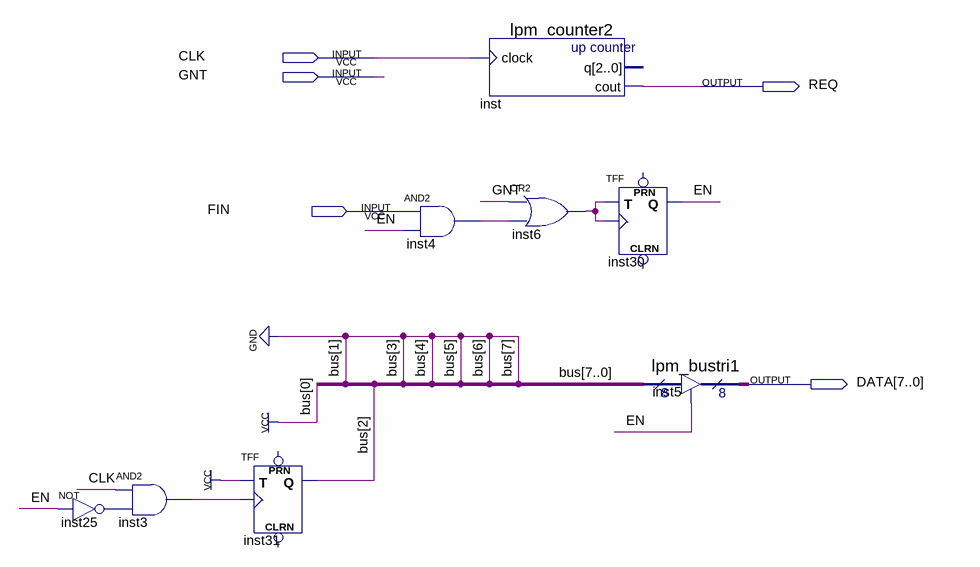
[diagram p0: schematic sheet]
// Quartus schematic master1.bdf as structural Verilog: 8 symbols, 5 pins
module master1 (
  input  CLK,
  input  GNT,
  input  FIN,
  output REQ,
  output [7:0] DATA
);

  wire EN, inst3_out, inst4_out, inst6_out, inst25_out;
  wire [2:2] bus;

  not inst25 (inst25_out, EN);
  and inst3 (inst3_out, CLK, inst25_out);
  TFF inst31 (.T(1'b1), .CLK(inst3_out), .Q(bus[2]));  // open: PRN, CLRN
  and inst4 (inst4_out, FIN, EN);
  lpm_counter2 inst (.clock(CLK), .cout(REQ));  // open: q
  or inst6 (inst6_out, GNT, inst4_out);
  TFF inst30 (.T(inst6_out), .CLK(inst6_out), .Q(EN));  // open: PRN, CLRN
  lpm_bustri1 inst5 (.enabledt(EN), .data({{5{1'b0}}, bus[2], 2'b01}), .tridata(DATA));
endmodule
